# EAGLE design M3 (EAGLE 9.6.1)
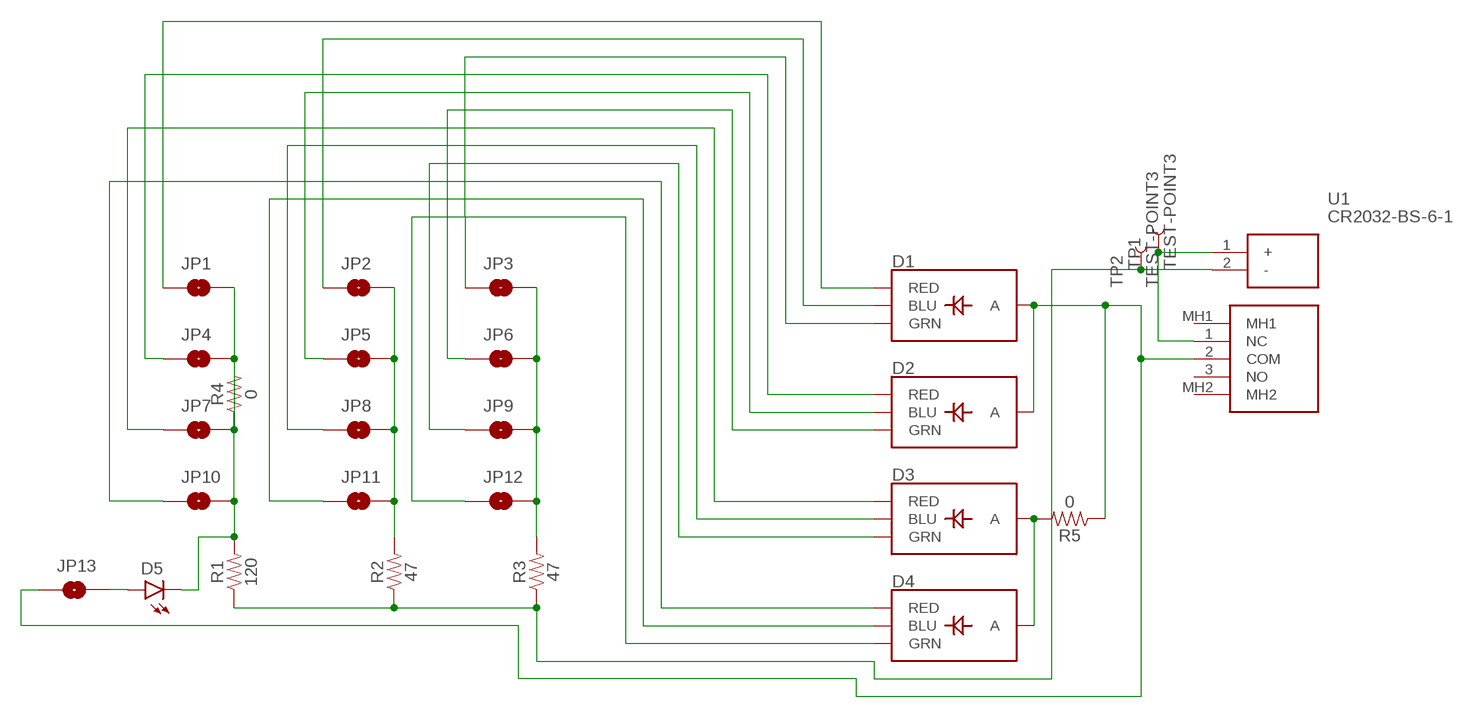
[diagram p0: schematic, sheet 1]

## Parts
D1  LED-RGB-CACLEAR  [LED-RGB-THRU]
D2  LED-RGB-CACLEAR  [LED-RGB-THRU]
D3  LED-RGB-CACLEAR  [LED-RGB-THRU]
D4  LED-RGB-CACLEAR  [LED-RGB-THRU]
D5  PWR  LED-FKIT-1206  [FKIT-LED-1206]
JP1  JUMPER-SMT_2_NO_SILK  [SMT-JUMPER_2_NO_SILK]
JP2  JUMPER-SMT_2_NO_SILK  [SMT-JUMPER_2_NO_SILK]
JP3  JUMPER-SMT_2_NO_SILK  [SMT-JUMPER_2_NO_SILK]
JP4  JUMPER-SMT_2_NO_SILK  [SMT-JUMPER_2_NO_SILK]
JP5  JUMPER-SMT_2_NO_SILK  [SMT-JUMPER_2_NO_SILK]
JP6  JUMPER-SMT_2_NO_SILK  [SMT-JUMPER_2_NO_SILK]
JP7  JUMPER-SMT_2_NO_SILK  [SMT-JUMPER_2_NO_SILK]
JP8  JUMPER-SMT_2_NO_SILK  [SMT-JUMPER_2_NO_SILK]
JP9  JUMPER-SMT_2_NO_SILK  [SMT-JUMPER_2_NO_SILK]
JP10  JUMPER-SMT_2_NO_SILK  [SMT-JUMPER_2_NO_SILK]
JP11  JUMPER-SMT_2_NO_SILK  [SMT-JUMPER_2_NO_SILK]
JP12  JUMPER-SMT_2_NO_SILK  [SMT-JUMPER_2_NO_SILK]
JP13  JUMPER-SMT_2_NO_SILK  [SMT-JUMPER_2_NO_SILK]
R1  120  RESISTOR1206  [1206]
R2  47  RESISTOR1206  [1206]
R3  47  RESISTOR1206  [1206]
R4  0  RESISTOR1206  [1206]
R5  0  RESISTOR1206  [1206]
S1  SK12D07VG4  [SK12D07VG4]
TP1  TEST-POINT3  [PAD.03X.03]
TP2  TEST-POINT3  [PAD.03X.03]
U1  CR2032-BS-6-1  [CR2032BS61]

## Nets
N$1: D1.2(A) D2.2(A) JP13.1 R5.1 S1.2(COM)
N$2: S1.1(NC) TP1.P$1 U1.1(+)
N$3: D1.1(RED) JP1.1
N$4: D5.A JP13.2
N$5: D1.4(BLU) JP2.1
N$6: D1.3(GRN) JP3.1
N$7: D2.4(BLU) JP5.1
N$8: D3.4(BLU) JP8.1
N$9: D2.3(GRN) JP6.1
N$10: D4.4(BLU) JP11.1
N$11: D3.3(GRN) JP9.1
N$12: D4.3(GRN) JP12.1
N$13: D2.1(RED) JP4.1
N$14: D3.1(RED) JP7.1
N$15: D4.1(RED) JP10.1
N$16: D5.C JP1.2 JP4.2 JP7.2 JP10.2 R1.2 R4.1 R4.2
N$17: JP3.2 JP6.2 JP9.2 JP12.2 R3.2
N$18: D3.2(A) D4.2(A) R5.2
N$24: JP2.2 JP5.2 JP8.2 JP11.2 R2.2
N$25: R1.1 R2.1 R3.1 TP2.P$1 U1.2(-)
Unconnected: S1.3(NO) S1.MH1 S1.MH2

## Library data of the parts
D1-D4 = SparkFun-LED:LED-RGB-CA: LED-RGB Diffused Common Anode Packages: LED RGB-THRU P-LCC-4-3 LED-TRICOLOR-SMD SparkFun Products: RGB Diffused Common Anode- Diffuse <[https://www.sparkfun.com/products/10821]> RGB Diffused Common Anode - Clear <[https://www.sparkfun.com/products/10820]> Qduino Mini <[https://www.sparkfun.com/products/13614]> Triple Output LED RGB - SMD <https://www.sparkfun.com/products/7844>; PROD_ID: DIO-10631; VALUE: CLEAR
D5 = SparkFun-LED:LED: LED (Generic) Standard schematic elements and footprints for 5mm, 3mm, 1206, and 0603 sized LEDs. Generic LEDs with no color specified.
JP1-JP13 = SparkFun-Jumpers:JUMPER-SMT_2_NO: Normally open jumper This jumper has two pads in close proximity to each other. Apply solder to close the connection. Round pads are easier to solder for beginners, but are a lot larger. SparkFun Product that uses the round pads: SparkFun EL Sequencer <https://www.sparkfun.com/products/12781>
R1-R5 = SparkFun-Resistors:RESISTOR: Generic Resistor Package
S1 = SK12D07VG4:SK12D07VG4: SPDT 500mA @ 50VDC 50V On-On Through Hole,P=2mm Toggle Switches RoHS Source: Datasheet <https://datasheet.lcsc.com/szlcsc/1912111437_SHOU-HAN-SK12D07VG4_C393937.pdf>; DESCRIPTION: SPDT 500mA @ 50VDC 50V On-On Through Hole,P=2mm Toggle Switches RoHS; HEIGHT: 4.7mm; MANUFACTURER_NAME: Shou Han; MANUFACTURER_PART_NUMBER: SK12D07VG4
TP1 TP2 = SparkFun-Connectors:TEST-POINT: SparkFun Test Points Bare copper test points for troubleshooting or In-Circuit-Testing. These are used by our Production team for verifying production board runs using pogo-pins on test beds. SparkFun Products: SparkFun LSM9DS1 Breakout <https://www.sparkfun.com/products/13284> SparkFun PSOC <https://www.sparkfun.com/products/13714> SparkFun Load Cell Amplifier <https://www.sparkfun.com/products/13879>
U1 = CR2032-BS-6-1:CR2032-BS-6-1: Battery Holders, Clips & Contacts SMD RoHS Source: Datasheet <https://datasheet.lcsc.com/szlcsc/Q-J-CR2032-BS-6-1_C70377.pdf>; DESCRIPTION: Battery Holders, Clips & Contacts SMD RoHS; HEIGHT: 6mm; MANUFACTURER_NAME: Q&J; MANUFACTURER_PART_NUMBER: CR2032-BS-6-1

## Board
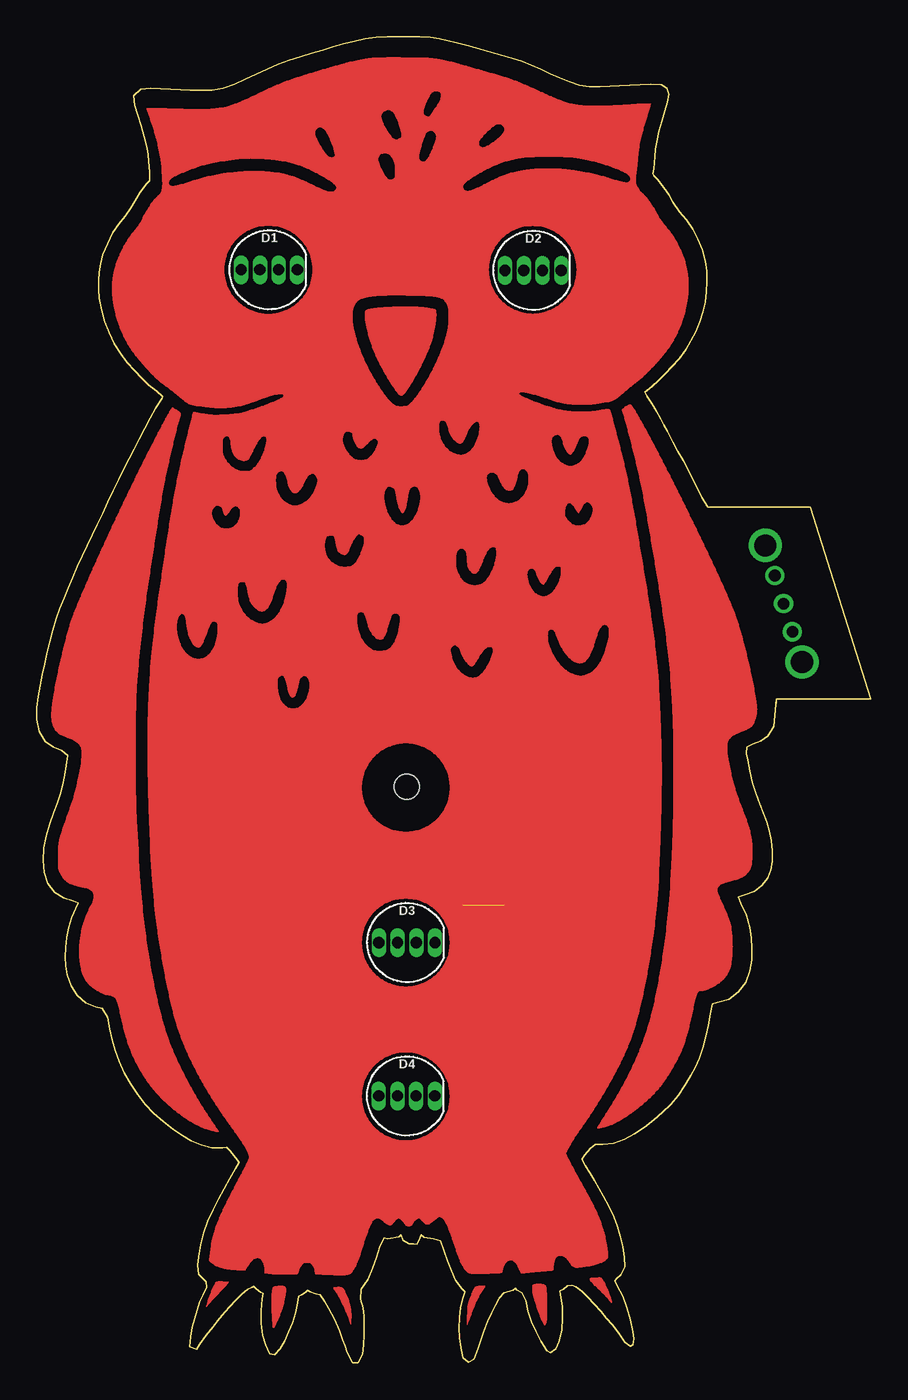
[diagram p1: board, top side]
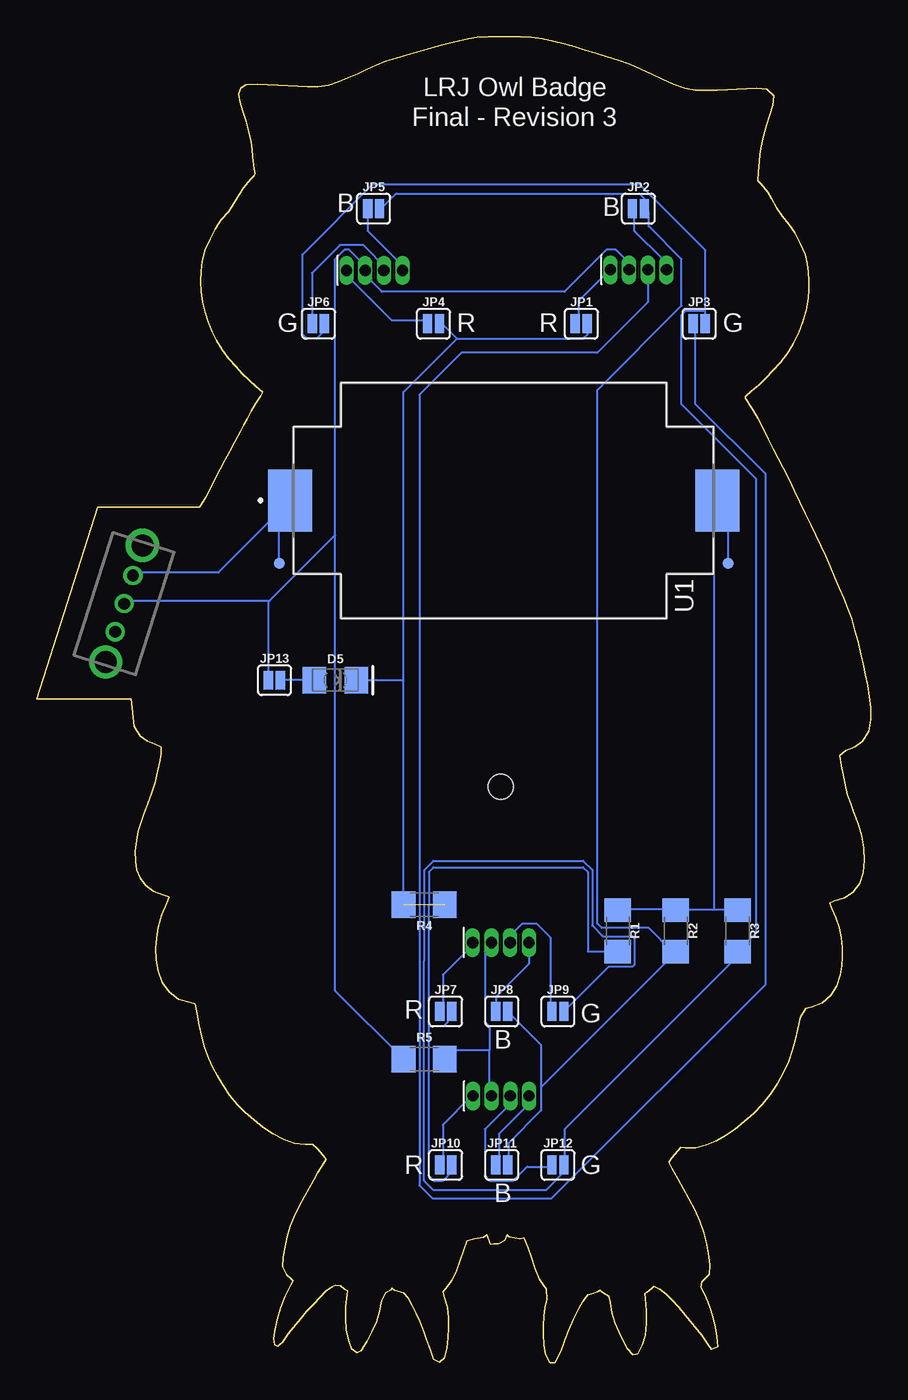
[diagram p2: board, bottom side, seen from below]

Size 56.61 x 89.98 mm. Coordinates in mm from the lower left corner, seen from the top.
Outline: 50.19,44.72 50.2,45.05
Outline: 50.2,45.05 50.02,43.16 49.6,42.53 49.14,42.2 48.61,41.98 48.19,41.8 48.18,41.35 48.25,40.9 48.4,40.14 48.58,39.39 48.81,38.65 49.09,37.93 49.33,37.32 49.54,36.71 49.72,36.08 49.85,35.44 49.92,34.74 49.91,34.03 49.82,33.46 49.62,32.91 49.23,32.37 48.69,31.99 48.04,31.75 47.63,31.62 47.8,31.16 48.15,30.37 48.39,29.55 48.49,28.84 48.53,28.12 48.52,27.35 48.39,26.58 48.11,25.81 47.63,25.15 46.98,24.67 46.2,24.44 45.86,24.36 45.73,23.67 45.59,22.9 45.43,22.13 45.22,21.38 44.95,20.64 44.69,20.05 44.38,19.48 43.98,18.81 43.53,18.15 43.03,17.55 42.47,16.99 41.88,16.47 41.24,15.98 40.58,15.53 39.87,15.16 39.12,14.88 38.42,14.81 37.9,14.82 37.58,14.55 37.18,14.06 36.99,13.8 37.24,13.36 37.55,12.87 37.84,12.37 38.14,11.83 38.45,11.29 38.82,10.61 39.16,9.91 39.42,9.24 39.62,8.55 39.78,7.86 39.89,7.15 39.93,6.51 39.65,5.95 39.35,5.68 39.24,5.55 39.39,5.26 39.77,4.51 40.06,3.72 40.3,2.91 40.47,2.08 40.53,1.63 40.47,1.2 40.28,1.12 39.93,1.39 39.52,2 39.05,2.57 38.67,3.02 38.3,3.47 37.84,3.97 37.37,4.46 37,4.83 36.59,5.14 36.33,5.25 36.01,5.21 35.73,4.99 35.51,4.86 35.55,4.61 35.67,3.83 35.67,3.04 35.63,2.21 35.43,1.4 35.25,0.95 34.88,0.67 34.62,0.82 34.21,1.45 33.87,2.12 33.57,2.78 33.35,3.47 33.2,4.19 32.93,4.75 32.57,4.95 32.49,5.03 32.33,4.92 31.72,4.73 31.42,4.4 31.14,3.89 30.87,3.36 30.59,2.78 30.36,2.18 30.15,1.57 29.94,0.95 29.69,0.24 29.29,0.02 28.94,0.35 28.78,1.01 28.71,1.68 28.67,2.36 28.68,3.05 28.75,3.74 28.93,4.42 29.05,4.8 28.86,5.02 28.43,5.59 28.13,6.24 27.89,6.91 27.65,7.59 27.41,8.27 26.92,8.4 26.28,8.52 26.08,8.68 26,8.47 25.81,8.02 25.58,8.07 25.27,8.08 24.84,8.31 24.71,8.67 24.58,8.55 23.82,8.4 23.56,8.49 23.27,7.84 23.05,7.16 22.79,6.39 22.48,5.64 22.02,4.98 21.98,4.29 22.14,3.73 22.21,3.14 22.23,2.55 22.23,1.89 22.19,1.23 22.09,0.58 21.8,0 21.43,0 21.43,0 21.06,0.7 20.91,1.14 20.75,1.57 20.53,2.18 20.2,2.94 19.82,3.67 19.54,4.16 19.22,4.61 18.93,4.66 18.56,4.8 18.39,4.9 18.23,4.78 17.96,4.62 17.78,4.52 17.69,4.06 17.57,3.38 17.37,2.72 17.1,2.08 16.8,1.46 16.53,0.95 16.14,0.53 15.81,0.6 15.51,1.21 15.32,1.85 15.23,2.68 15.22,3.51 15.3,4.33 15.35,4.7 15.21,4.78 14.9,5 14.72,5.18 14.6,5.1 14.32,4.97 13.9,4.65 13.52,4.26 13.05,3.75 12.59,3.23 12.27,2.84 11.96,2.45 11.49,1.86 11.06,1.24 10.84,0.92 10.39,1.09 10.45,1.75 10.56,2.4 10.7,2.98 10.87,3.55 11.06,4.12 11.27,4.62 11.53,5.1 11.48,5.47 10.98,6.01 10.92,6.59 10.98,7.18 11.12,8.01 11.32,8.82 11.61,9.6 11.96,10.36 12.34,11.1 12.72,11.8 13.1,12.49 13.5,13.17 13.72,13.59 13.5,13.89 13.11,14.36 12.89,14.61 12.61,14.58 11.87,14.58 11.16,14.77 10.49,15.07 9.85,15.43 9.24,15.84 8.57,16.36 7.93,16.91 7.35,17.54 6.83,18.22 6.36,18.94 5.94,19.68 5.59,20.46 5.33,21.18 5.12,21.92 4.95,22.66 4.81,23.42 4.43,24.06 4.01,24.13 3.3,24.43 2.73,24.93 2.33,25.59 2.08,26.31 1.97,26.93 1.93,27.55 1.95,28.18 2.02,28.87 2.15,29.55 2.37,30.2 2.65,30.84 2.79,31.22 2.48,31.33 1.81,31.53 1.22,31.9 0.75,32.51 0.51,33.28 0.43,34.09 0.48,34.92 0.63,35.74 0.87,36.54 1.15,37.33 1.38,37.94 1.59,38.57 1.75,39.2 1.89,39.87 2.01,40.54 2.1,41.21 1.7,41.55 1.1,41.78 0.58,42.15 0.15,42.84 0,43.65 0,44.47 0.1,45.21 0.23,45.95 0.37,46.68 0.52,47.42 0.68,48.1 0.87,48.9 1.08,49.7 1.31,50.49 1.56,51.19 1.84,51.88 2.13,52.57 2.44,53.3 2.75,54.02 3.07,54.74 3.41,55.45 3.75,56.17 4.09,56.87 4.46,57.64 4.82,58.41 5.18,59.18 5.55,59.95 5.94,60.71 6.28,61.36 6.61,62.01 6.95,62.67 7.31,63.38 7.68,64.09 8.07,64.8 8.51,65.47 8.54,65.58 8.12,65.92 7.6,66.36 7.12,66.83 6.65,67.32 6.14,67.88 5.69,68.48 5.26,69.17 4.9,69.9 4.61,70.66 4.39,71.44 4.25,72.25 4.21,72.83 4.21,73.42 4.23,74 4.32,74.6 4.47,75.18 4.79,75.94 5.16,76.68 5.56,77.26 6.01,77.81 6.38,78.35 6.76,79.02 7,79.43 7.46,80 7.67,80.22 7.65,80.81 7.58,81.54 7.54,81.99 7.47,82.43 7.29,83.19 7.08,83.94 6.85,84.68 6.64,85.32 6.59,85.98 7.06,86.42 7.74,86.49 8.41,86.45 9.08,86.42 9.75,86.39 10.42,86.37 11.17,86.36 11.91,86.36 12.64,86.5 13.41,86.75 14.15,87.09 14.88,87.44 15.62,87.79 16.37,88.11 17.14,88.4 17.92,88.64 18.65,88.86 19.39,89.08 20.1,89.3 20.83,89.5 21.55,89.68 22.29,89.83 23.03,89.94 23.77,89.97 24.51,89.98 25.25,89.98 26,89.97 26.74,89.94 27.33,89.84 27.92,89.72 28.5,89.58 29.31,89.38 30.12,89.14 30.83,88.94 31.54,88.74 32.24,88.54 32.94,88.31 33.58,88.06 34.2,87.77 34.83,87.48 35.48,87.19 36.14,86.92 36.82,86.7 37.52,86.59 38.24,86.59 38.9,86.62 39.56,86.65 40.25,86.68 40.94,86.72 41.67,86.77 42.41,86.73 42.77,86.5 42.92,86.1 42.8,85.53 42.63,84.96 42.42,84.26 42.23,83.56 42.07,82.85 41.99,82.35 41.95,81.84 41.88,81.03 41.81,80.69 41.87,80.55 42.11,80.31 42.56,79.75 42.89,79.25 43.18,78.76 43.61,78.12 44.1,77.55 44.52,76.93 44.86,76.26 45.18,75.53 45.38,74.76 45.47,74.07 45.5,73.37 45.46,72.68 45.36,71.99 45.2,71.3 44.99,70.64 44.73,69.99 44.41,69.36 44.05,68.76 43.6,68.16 43.1,67.59 42.67,67.12 42.22,66.67 41.74,66.25 41.28,65.86 41.42,65.61 41.76,65.1 42.06,64.57 42.35,64.04 42.57,63.62 42.8,63.21 43.18,62.48 43.53,61.84 43.87,61.21 44.18,60.64 44.47,60.07 44.76,59.49 45.14,58.72 45.57,58.07 52.49,58.07 56.61,45.05 50.2,45.05
Copper layers (1*16): Top 0.035mm / dielectric 1.5mm / Bottom 0.035mm
Design rules "default *": minimum track width 6mil, minimum drill 0.35mm, track to track 6mil, track to pad 6mil, pad to pad 6mil, via to via 6mil, smd to smd 6mil, copper to edge 40mil, drill to drill 6mil, minimum pad ring 4mil, minimum via ring 8mil, stop-mask expansion 4mil, vias tented up to drill 0mil, thermal gap 10mil
Holes 1.7 mm at 25.12,39.08

### Footprints (pad centres in the part's own frame; a part is rotated, then mirrored left to right if it is on the bottom)
LED-RGB-THRU = drill 0.762 pad 0.889 long: 1 1.905,0; 2 0.635,0; 3 -0.635,0; 4 -1.905,0
FKIT-LED-1206 = smd 1.6 x 1.803: A -1.422,0; C 1.422,0
SMT-JUMPER_2_NO_SILK = smd 0.635 x 1.27: 1 -0.406,0; 2 0.406,0
1206 = smd 1.6 x 1.8: 1 -1.4,0; 2 1.4,0
SK12D07VG4 = drill 0.8 pad 1.3: 1 0,0; 2 2,0; 3 4,0 | drill 1.5 pad 2.25: MH1 -2.15,0; MH2 6.15,0
PAD.03X.03 = smd 0.762 x 0.762: P$1 0,0
CR2032BS61 = smd 4.2 x 3: 1 0,14.5; 2 0,-14.5

### Placement (x,y rotation side)
D1  15.78,74.17 0 top
D2  33.69,74.13 0 top
D3  25.12,28.51 0 top
D4  25.11,18.1 0 top
D5  36.36,46.32 0 bottom
JP1  19.66,70.51 0 bottom
JP2  15.78,78.32 0 bottom
JP3  11.66,70.51 0 bottom
JP4  29.69,70.51 0 bottom
JP5  33.75,78.32 0 bottom
JP6  37.5,70.51 0 bottom
JP7  28.86,23.84 0 bottom
JP8  25.05,23.84 0 bottom
JP9  21.24,23.84 0 bottom
JP10  28.86,13.43 0 bottom
JP11  25.05,13.43 0 bottom
JP12  21.24,13.43 0 bottom
JP13  40.49,46.32 0 bottom
R1  17.18,29.3 270 bottom
R2  13.24,29.3 270 bottom
R3  9.05,29.3 270 bottom
R4  30.33,31.08 180 bottom
R5  30.33,20.6 0 bottom
S1  50.09,53.42 287.5 top
TP1  40.17,54.26 0 bottom
TP2  9.69,54.26 0 bottom
U1  24.93,58.51 90 bottom

### Tracks (layer width: path | path; a pad name or v marks a point on that pad's centre or on a via)
N$1
  Bottom 0.152: D1.2 16.67,74.26 16.67,74.89 17.31,75.53 17.94,75.53 20.8,72.67 33.18,72.67 34.13,73.62 34.13,73.94 D2.2 34.13,74.26 35.4,75.53 35.72,75.53 36.36,74.89 36.36,56.16 | 40.8,51.72 50.65,51.72 S1.2 | 40.8,51.72 36.36,56.16 | R5.1 36.36,25.23 36.36,56.16 | JP13.1 40.89,51.63 40.8,51.72
N$2
  Bottom 0.152: 40.33,57.59 39.53,58.38 U1.1 | 40.33,57.59 44.3,53.62 50.01,53.62 S1.1 | TP1.P$1 40.17,57.43 40.33,57.59
N$3
  Bottom 0.152: JP1.1 19.85,70.77 19.85,72.04 17.94,73.94 D1.1
N$4
  Bottom 0.152: D5.A JP13.2
N$5
  Bottom 0.152: JP2.1 16.04,78.07 16.04,76.8 14.13,74.89 14.13,74.26 D1.4
N$6
  Bottom 0.152: JP3.1 11.91,70.45 11.91,65.05 7.15,60.29 7.15,25.68 21.69,11.14 29.75,11.14 30.64,12.03 30.64,65.69 27.78,68.54 18.58,68.54 15.14,71.98 D1.3
N$7
  Bottom 0.152: JP5.1 34.13,78.07 34.13,76.8 31.6,74.26 D2.4
N$8
  Bottom 0.152: D3.4 23.22,27.07 25.46,24.83 JP8.1
N$9
  Bottom 0.152: JP6.1 37.94,70.77 37.94,73.94 36.04,75.85 34.45,75.85 32.87,74.26 D2.3
N$10
  Bottom 0.152: JP11.1 25.24,13.62 25.24,15.52 23.34,17.43 23.34,18.06 D4.4
N$11
  Bottom 0.152: JP9.1 21.75,24.09 21.75,28.86 22.71,29.81 23.66,29.81 24.29,29.17 24.29,28.54 D3.3
N$12
  Bottom 0.152: JP12.1 21.75,13.3 23.34,13.3 24.29,12.35 25.88,12.35 26.2,12.66 26.2,15.84 24.61,17.43 24.61,18.06 D4.3
N$13
  Bottom 0.152: JP4.1 30.33,70.77 32.55,70.77 35.72,73.94 D2.1
N$14
  Bottom 0.152: JP7.1 29.05,24.09 29.05,26.32 27.15,28.22 D3.1
N$15
  Bottom 0.152: JP10.1 29.05,13.62 29.05,16.16 27.15,18.06 D4.1
N$16  (1 unrouted)
  Bottom 0.152: 28.1,69.5 19.53,69.5 19.21,69.81 19.21,70.45 JP1.2 | 28.1,69.5 29.05,70.45 JP4.2 | R4.2 31.72,46.32 | 31.72,46.32 31.72,65.87 28.1,69.5 | JP10.2 28.42,13.3 28.42,12.98 29.05,12.35 29.69,12.35 30.01,12.66 30.01,22.82 | R1.2 17.31,27.9 19.21,27.9 19.21,33.3 19.53,33.62 29.69,33.62 30.01,33.3 30.01,31.08 | 30.01,22.82 30.01,31.08 | R4.1 30.01,31.08 | JP7.2 28.72,23.57 28.72,23.11 29.01,22.82 30.01,22.82 | D5.C 31.72,46.32
N$17
  Bottom 0.152: 11.28,71.4 11.28,75.53 15.72,79.97 33.82,79.97 38.58,75.21 38.58,69.81 38.26,69.5 37.63,69.5 37.31,69.81 37.31,70.45 JP6.2 | 11.28,71.4 11.28,70.77 JP3.2 | 11.28,71.4 12.55,71.4 12.86,71.08 12.86,65.05 7.78,59.97 7.78,29.17 R3.2 9.05,27.59 20.8,15.84 20.8,13.62 JP12.2 20.8,13.3 20.8,12.98 22.07,11.71 29.69,11.71 30.33,12.35 30.33,27.27 30.31,27.28 30.31,33.43 29.69,34.05 19.53,34.05 18.91,33.43 18.91,29.66 18.18,28.93 16.19,28.93 16.05,28.8 16.05,27.01 16.19,26.87 17.81,26.87 JP9.2
N$18
  Bottom 0.152: 25.88,21.24 25.88,22.82 26.2,23.14 26.2,27.9 25.88,28.22 D3.2 | R5.2 28.29,21.24 25.88,21.24 | D4.2 25.88,18.24 25.88,21.24
N$24
  Bottom 0.152: JP5.2 33.18,78.39 32.23,79.34 15.72,79.34 15.4,79.02 15.4,78.39 JP2.2 15.08,78.07 15.08,77.12 12.86,74.89 12.86,71.72 18.58,66 18.58,29.81 18.26,29.49 15.08,29.49 13.5,27.9 R2.2 13.5,27.59 22.39,18.7 | 22.39,18.7 22.39,21.55 24.61,23.78 JP8.2 | 22.39,18.7 22.39,17.11 24.61,14.89 24.61,13.62 JP11.2
N$25
  Bottom 0.152: 10.64,30.76 13.18,30.76 R2.1 13.5,30.76 16.99,30.76 R1.1 | 10.64,30.76 9.05,30.76 R3.1 | 10.64,30.76 10.64,57.43 | 10.64,57.43 10.64,58.38 U1.2 | TP2.P$1 9.69,56.48 10.64,57.43
(copper drawn outside any net)
  shapes: Top area x11216

### Text on the board
bPlace: B | B | G | R | R | G | R | G | B | G | R | B
bNames: LRJ Owl Badge | Final - Revision 3
tStop: C:/Users/Mcharlsto/Desktop/owl-with-led.bmp